# EAGLE design GPIB-Arduino_DoubleSide (EAGLE 9.0.1)
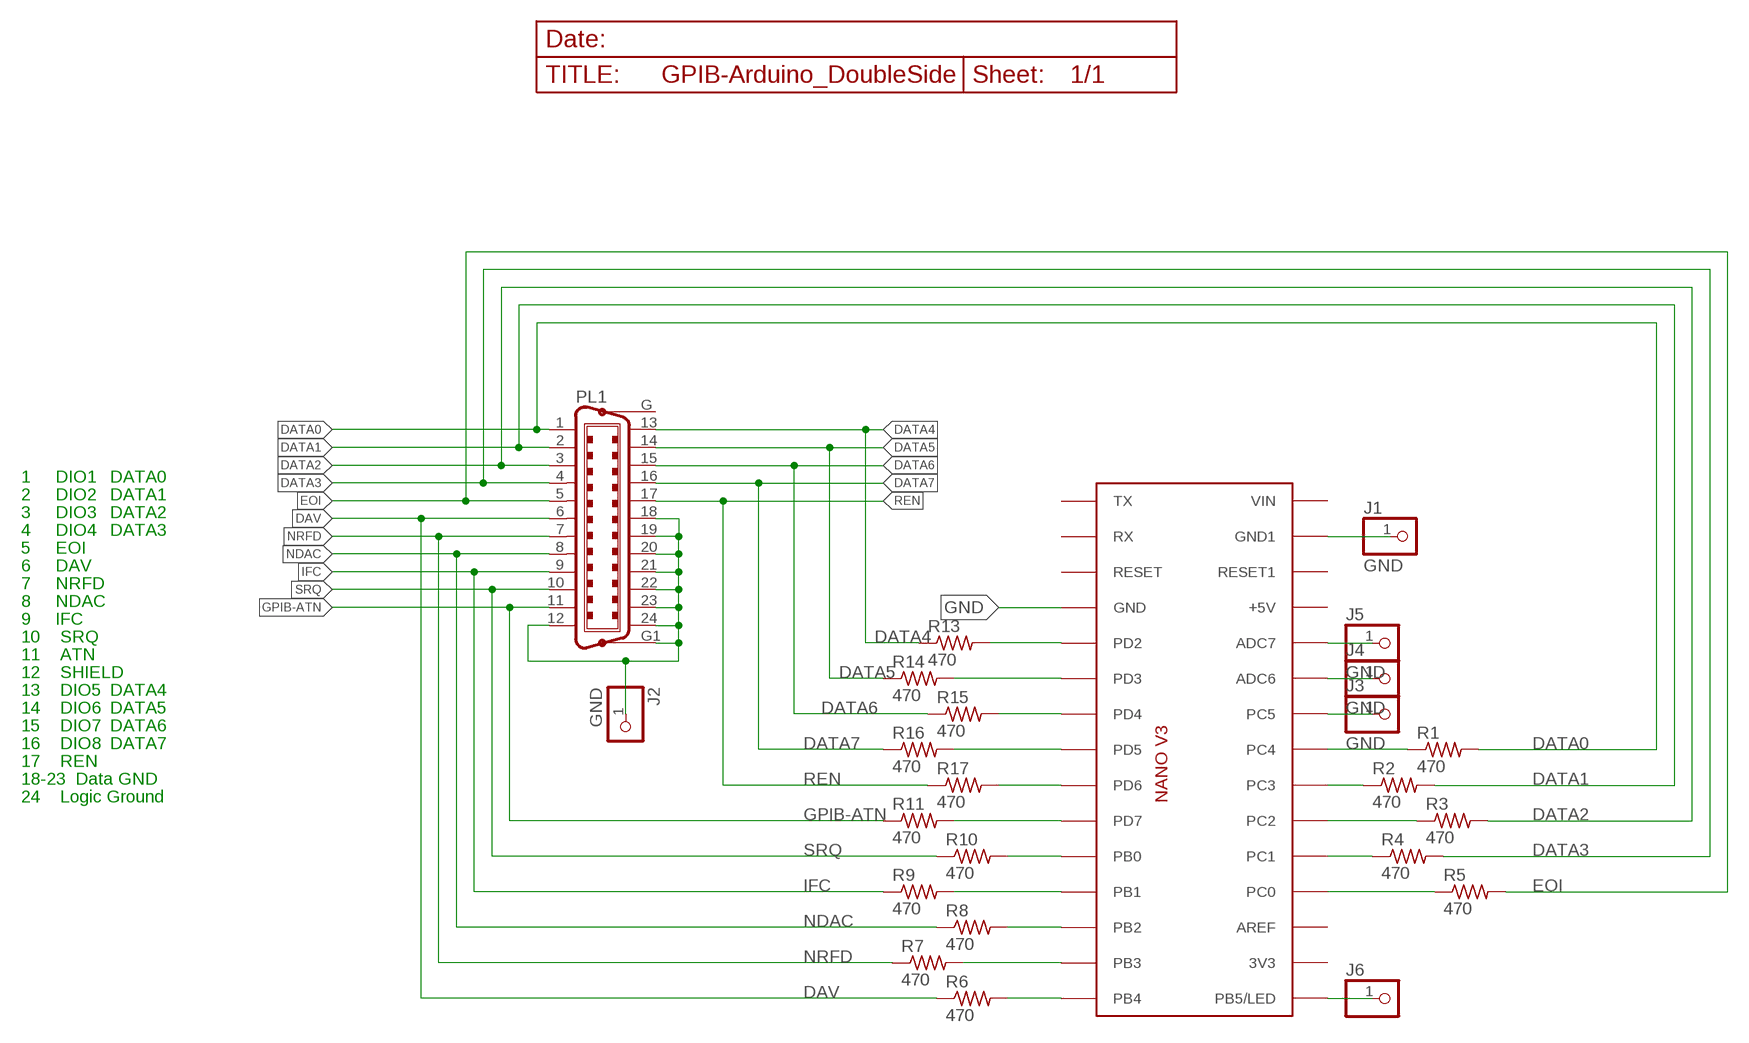
[diagram p0: schematic, sheet 1]

## Parts
J1  GND  PINHD1X01ROUND  [1X01_ROUND]
J2  GND  PINHD1X01ROUND  [1X01_ROUND]
J3  GND  PINHD1X01ROUND  [1X01_ROUND]
J4  GND  PINHD1X01ROUND  [1X01_ROUND]
J5  GND  PINHD1X01ROUND  [1X01_ROUND]
J6  PINHD1X01ROUND  [1X01_ROUND]
PL1  C24HP  [24HP]
R1  470  R-USR-1/8W  [R-1/8W]
R2  470  R-USR-1/8W  [R-1/8W]
R3  470  R-USR-1/8W  [R-1/8W]
R4  470  R-USR-1/8W  [R-1/8W]
R5  470  R-USR-1/8W  [R-1/8W]
R6  470  R-USR-1/8W  [R-1/8W]
R7  470  R-USR-1/8W  [R-1/8W]
R8  470  R-USR-1/8W  [R-1/8W]
R9  470  R-USR-1/8W  [R-1/8W]
R10  470  R-USR-1/8W  [R-1/8W]
R11  470  R-USR-1/8W  [R-1/8W]
R13  470  R-USR-1/8W  [R-1/8W]
R14  470  R-USR-1/8W  [R-1/8W]
R15  470  R-USR-1/8W  [R-1/8W]
R16  470  R-USR-1/8W  [R-1/8W]
R17  470  R-USR-1/8W  [R-1/8W]
U$6  ARDUINONANO  [PDIP-32]

## Nets
DATA0: PL1.1 R1.2
DATA1: PL1.2 R2.2
DATA2: PL1.3 R3.2
DATA3: PL1.4 R4.2
DATA4: PL1.13 R13.1
DATA5: PL1.14 R14.1
DATA6: PL1.15 R15.1
DATA7: PL1.16 R16.1
DAV: PL1.6 R6.1
EOI: PL1.5 R5.2
GND: J1.1 J2.1 PL1.12 PL1.18 PL1.19 PL1.20 PL1.21 PL1.22 PL1.23 PL1.24 PL1.G1 U$6.GND U$6.GND1
GPIB-ATN: PL1.11 R11.1
IFC: PL1.9 R9.1
N$1: R1.1 U$6.A3(PC4)
N$2: R2.1 U$6.A4(PC3)
N$3: R3.1 U$6.A5(PC2)
N$4: R4.1 U$6.A6(PC1)
N$5: R5.1 U$6.A7(PC0)
N$6: R11.2 U$6.D7
N$7: R10.2 U$6.D8(PB0)
N$8: R9.2 U$6.D9(PB1)
N$9: R8.2 U$6.D10(PB2)
N$10: R7.2 U$6.D11(PB3)
N$11: R6.2 U$6.D12(PB4)
N$12: J5.1 U$6.A0(ADC7)
N$13: R13.2 U$6.D2
N$14: R14.2 U$6.D3
N$15: R15.2 U$6.D4
N$16: R16.2 U$6.D5
N$17: R17.2 U$6.D6
N$18: J4.1 U$6.A1(ADC6)
N$19: J3.1 U$6.A2(PC5)
N$20: J6.1 U$6.D13(PB5/LED)
NDAC: PL1.8 R8.1
NRFD: PL1.7 R7.1
REN: PL1.17 R17.1
SRQ: PL1.10 R10.1
Unconnected: PL1.G U$6.3V3 U$6.+5V U$6.AREF U$6.D0/RX(RX) U$6.D1/TX(TX) U$6.RESET U$6.RESET1 U$6.VIN

## Notes on the sheet
- 1     DIO1 | DATA0
- 2     DIO2 | DATA1
- 3     DIO3 | DATA2
- 4     DIO4 | DATA3
- 5     EOI
- 6     DAV
- 7     NRFD
- 8     NDAC
- 9     IFC
- 10    SRQ
- 11    ATN
- 12    SHIELD
- 13    DIO5 | DATA4
- 14    DIO6 | DATA5
- 15    DIO7 | DATA6
- 16    DIO8 | DATA7
- 17    REN
- 18-23  Data GND
- 24    Logic Ground

## Library data of the parts
J1-J6 = assorted:PINHD1X01
PL1 = con-amp-champ2:C24HP: CONNECTOR; OC_FARNELL: unknown; OC_NEWARK: unknown
R1-R11 R13-R17 = assorted:R-US
U$6 = Arduino:ARDUINONANO

## Net classes
0 default: width 0.508 mm, drill 1.016 mm, clearance 0.508 mm
1 PWR: width 0.508 mm, drill 1.016 mm, clearance 0.508 mm

## Board
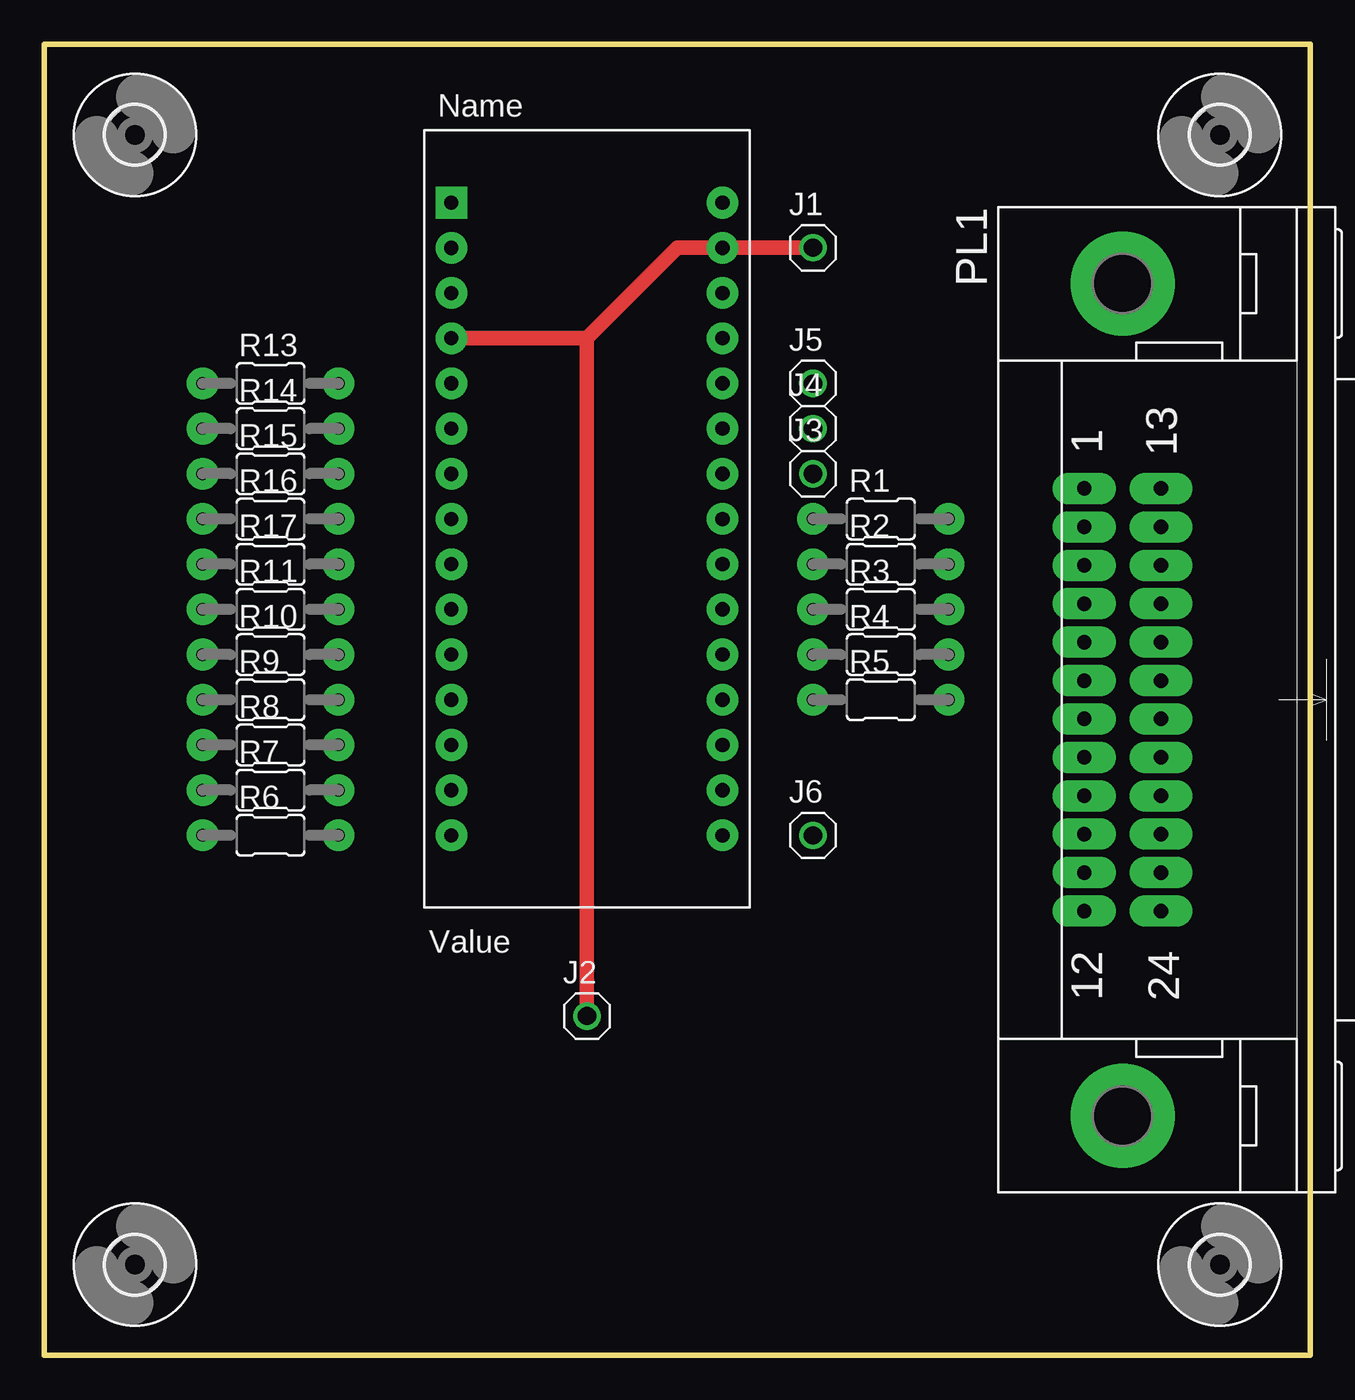
[diagram p1: board, top side]
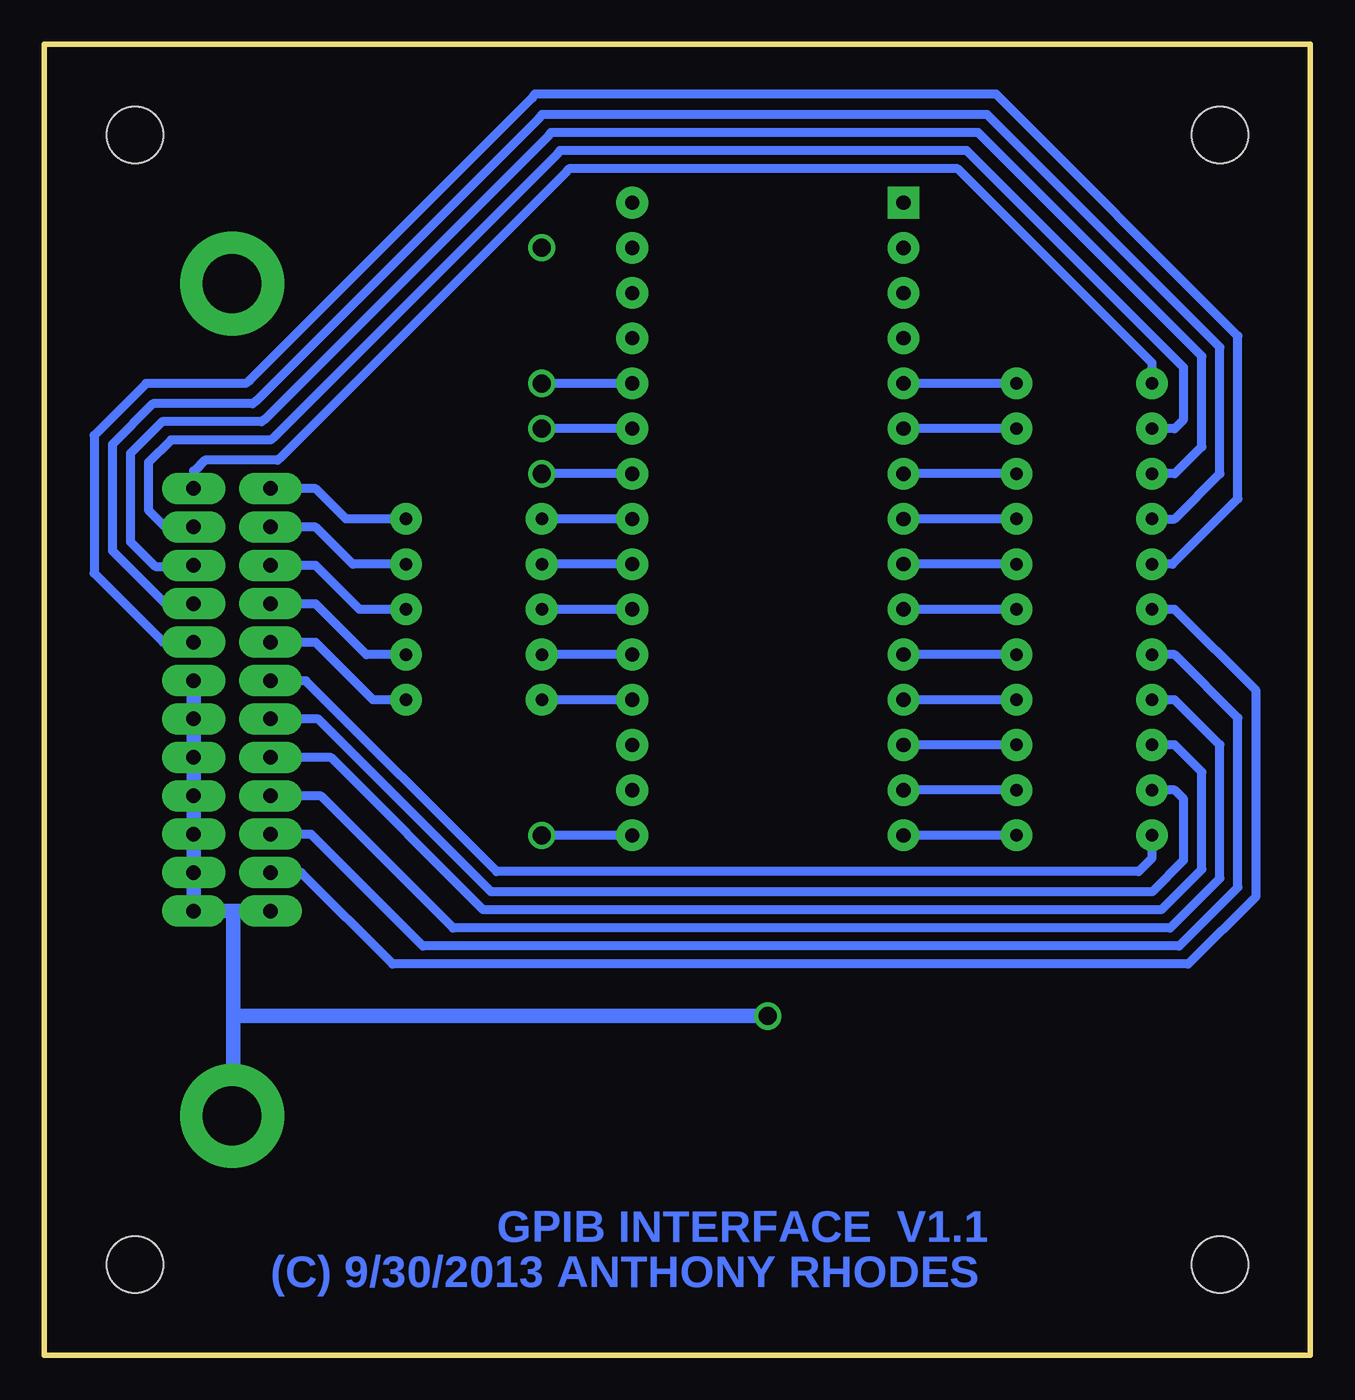
[diagram p2: board, bottom side, seen from below]

Size 71.12 x 73.66 mm. Coordinates in mm from the lower left corner, seen from the top.
Outline: 0,0 71.12,0 71.12,73.66 0,73.66 0,0
Copper layers (1*16): Top 0.035559375mm / dielectric 1.6mm / Bottom 0.035559375mm
Design rules "oshpark-2layer": minimum track width 6mil, minimum drill 10mil, track to track 6mil, track to pad 6mil, pad to pad 6mil, via to via 6mil, smd to smd 6mil, copper to edge 15mil, drill to drill 6mil, minimum pad ring 5mil, minimum via ring 5mil, stop-mask expansion 2.5mil, vias tented up to drill 0mil, thermal gap 10mil

### Footprints (pad centres in the part's own frame; a part is rotated, then mirrored left to right if it is on the bottom)
1X01_ROUND = drill 1.016: 1 0,0
24HP = drill 0.813 pad 1.778 long: 1 -11.874,-2.159; 2 -9.716,-2.159; 3 -7.556,-2.159; 4 -5.397,-2.159; 5 -3.239,-2.159; 6 -1.079,-2.159; 7 1.079,-2.159; 8 3.239,-2.159; 9 5.397,-2.159; 10 7.556,-2.159; 11 9.716,-2.159; 12 11.874,-2.159; 13 -11.874,2.159; 14 -9.716,2.159; 15 -7.556,2.159; 16 -5.397,2.159; 17 -3.239,2.159; 18 -1.079,2.159; 19 1.079,2.159; 20 3.239,2.159; 21 5.397,2.159; 22 7.556,2.159; 23 9.716,2.159; 24 11.874,2.159 | drill 3.302 pad 5.842: G -23.393,0; G1 23.393,0
R-1/8W = drill 0.7 pad 1.778: 1 -3.81,0; 2 3.81,0
3,2 = hole 3.2: 0,0
PDIP-32 = drill 0.8 pad 1.778: 3V3 7.62,-16.51; +5V 7.62,8.89; A0 7.62,6.35; A1 7.62,3.81; A2 7.62,1.27; A3 7.62,-1.27; A4 7.62,-3.81; A5 7.62,-6.35; A6 7.62,-8.89; A7 7.62,-11.43; AREF 7.62,-13.97; D0/RX -7.62,13.97; D2 -7.62,6.35; D3 -7.62,3.81; D4 -7.62,1.27; D5 -7.62,-1.27; D6 -7.62,-3.81; D7 -7.62,-6.35; D8 -7.62,-8.89; D9 -7.62,-11.43; D10 -7.62,-13.97; D11 -7.62,-16.51; D12 -7.62,-19.05; D13 7.62,-19.05; GND -7.62,8.89; GND1 7.62,13.97; RESET -7.62,11.43; RESET1 7.62,11.43; VIN 7.62,16.51 | drill 0.8 pad 1.778 square: D1/TX -7.62,16.51

### Placement (x,y rotation side)
J1  43.18,62.23 0 top
J2  30.48,19.05 0 top
J3  43.18,49.53 0 top
J4  43.18,52.07 0 top
J5  43.18,54.61 0 top
J6  43.18,29.21 0 top
PL1  60.58,36.83 270 top
R1  46.99,46.99 0 top
R2  46.99,44.45 0 top
R3  46.99,41.91 0 top
R4  46.99,39.37 0 top
R5  46.99,36.83 0 top
R6  12.7,29.21 0 top
R7  12.7,31.75 0 top
R8  12.7,34.29 0 top
R9  12.7,36.83 0 top
R10  12.7,39.37 0 top
R11  12.7,41.91 0 top
R13  12.7,54.61 0 top
R14  12.7,52.07 0 top
R15  12.7,49.53 0 top
R16  12.7,46.99 0 top
R17  12.7,44.45 0 top
U$1  [3,2]  5.08,68.58 0 top
U$2  [3,2]  5.08,5.08 0 top
U$3  [3,2]  66.04,5.08 0 top
U$5  [3,2]  66.04,68.58 0 top
U$6  30.48,48.26 0 top

### Tracks (layer width: path | path; a pad name or v marks a point on that pad's centre or on a via)
DATA0
  Bottom 0.508: R1.2 54.18,46.99 55.88,48.69 PL1.1
DATA1
  Bottom 0.508: R2.2 53.8,44.45 55.88,46.53 58.42,46.53 PL1.2
DATA2
  Bottom 0.508: R3.2 53.42,41.91 55.88,44.37 58.42,44.37 PL1.3
DATA3
  Bottom 0.508: R4.2 53.04,39.37 55.88,42.22 58.42,42.22 PL1.4
DATA4
  Bottom 0.508: PL1.13 62.74,49.71 62.69,49.71 62.1,50.29 58.04,50.29 57.84,50.44 41.81,66.47 41.66,66.67 19.81,66.67 8.89,55.75 R13.1
DATA5
  Bottom 0.508: PL1.14 64.33,46.55 65.28,47.5 65.28,50.17 64.01,51.44 58.42,51.44 58.22,51.59 42.32,67.49 42.16,67.69 19.3,67.69 7.11,55.5 7.11,52.58 7.62,52.07 R14.1
DATA6
  Bottom 0.508: PL1.15 62.74,44.32 64.9,44.32 66.29,45.72 66.29,50.67 64.52,52.45 58.93,52.45 58.73,52.6 42.82,68.5 42.67,68.71 18.67,68.71 6.1,56.13 6.1,51.05 7.62,49.53 R15.1
DATA7
  Bottom 0.508: PL1.16 64.33,42.23 67.31,45.21 67.31,51.18 65.02,53.47 59.44,53.47 59.23,53.62 43.33,69.52 43.18,69.72 18.16,69.72 5.08,56.64 5.08,49.53 7.62,46.99 R16.1
DAV
  Bottom 0.508: R6.1 8.89,27.94 9.65,27.18 45.72,27.18 56.44,37.9 58.42,37.9 PL1.6
EOI
  Bottom 0.508: R5.2 52.65,36.83 55.88,40.06 58.42,40.06 PL1.5
GND
  Top 0.813: 30.48,57.15 35.56,62.23 J1.1 U$6.GND1 | 30.48,57.15 J2.1 | U$6.GND 30.48,57.15
  Bottom 0.813: 60.53,24.97 58.37,24.97 58.37,24.96 PL1.12 | 60.53,19.05 60.53,24.97 | J2.1 60.53,19.05 | PL1.18 PL1.19 PL1.20 PL1.21 PL1.22 PL1.23 PL1.24 60.53,24.97 | PL1.G1 60.53,13.44 60.53,19.05
GPIB-ATN
  Bottom 0.508: R11.1 7.62,41.91 3.05,37.34 3.05,25.78 6.86,21.97 51.56,21.97 56.69,27.1 PL1.11
IFC
  Bottom 0.508: R9.1 7.62,36.83 5.08,34.29 5.08,26.8 7.87,24 48.16,24 55.58,31.42 PL1.9
N$1
  Bottom 0.508: U$6.A3 R1.1
N$2
  Bottom 0.508: U$6.A4 R2.1
N$3
  Bottom 0.508: U$6.A5 R3.1
N$4
  Bottom 0.508: U$6.A6 R4.1
N$5
  Bottom 0.508: U$6.A7 R5.1
N$6
  Bottom 0.508: R11.2 U$6.D7
N$7
  Bottom 0.508: R10.2 U$6.D8
N$8
  Bottom 0.508: R9.2 U$6.D9
N$9
  Bottom 0.508: R8.2 U$6.D10
N$10
  Bottom 0.508: R7.2 U$6.D11
N$11
  Bottom 0.508: R6.2 U$6.D12
N$12
  Bottom 0.508: U$6.A0 J5.1
N$13
  Bottom 0.508: R13.2 U$6.D2
N$14
  Bottom 0.508: R14.2 U$6.D3
N$15
  Bottom 0.508: R15.2 U$6.D4
N$16
  Bottom 0.508: R16.2 U$6.D5
N$17
  Bottom 0.508: R17.2 U$6.D6
N$18
  Bottom 0.508: U$6.A1 J4.1
N$19
  Bottom 0.508: U$6.A2 J3.1
N$20
  Bottom 0.508: U$6.D13 J6.1
NDAC
  Bottom 0.508: R8.1 7.62,34.29 6.1,32.77 6.1,27.3 8.38,25.02 46.46,25.02 55.02,33.58 58.42,33.58 PL1.8
NRFD
  Bottom 0.508: R7.1 7.62,31.75 7.11,31.24 7.11,27.81 8.89,26.04 46.02,26.04 55.73,35.74 58.42,35.74 PL1.7
REN
  Bottom 0.508: PL1.17 64.45,40.07 68.33,43.94 68.33,51.69 65.41,54.61 59.82,54.61 59.61,54.76 43.71,70.66 43.56,70.87 17.65,70.87 4.06,57.28 4.06,48.13 7.75,44.45 R17.1
SRQ
  Bottom 0.508: R10.1 7.62,39.37 4.06,35.81 4.06,26.29 7.37,22.99 49.86,22.99 56.13,29.26 PL1.10

### Text on the board
Bottom: GPIB INTERFACE V1.1 | (C) 9/30/2013 ANTHONY RHODES